# Altium schematic sheet FAN_CTRL.SchDoc
size A4
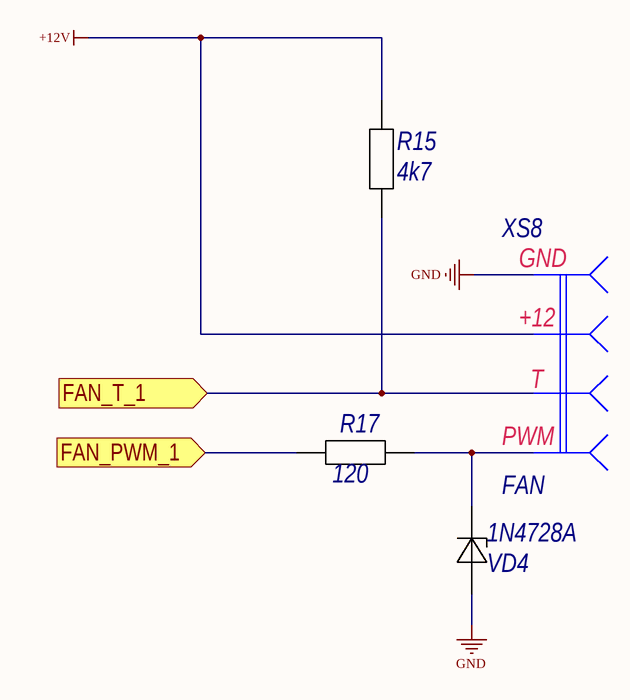
[diagram p0: FAN_CTRL.SchDoc]

## Parts
R15  4k7  [C0805R]
R17  120  [C0805R]
VD4  1N4728A  [DO-41]
XS8  FAN  [WF-4]

## Ports
FAN_PWM_1 (in), FAN_T_1 (in)

## Nets
+12V: R15.2 XS8.2
GND: VD4.1(А) XS8.1
FAN_PWM_1: R17.1 ; port FAN_PWM_1
FAN_T_1: R15.1 XS8.3 ; port FAN_T_1
NetR17_2: R17.2 VD4.2(К) XS8.4

## Notes on the sheet
- (in symbol FAN_CON) GND; +12; T; PWM

## Library data of the parts
R15 R17 = RES_0805: Published: 24.03.2010; Publisher: Andrew Danich; Type: Резистор
VD4 = 1N4728A: Type: Стабилитрон; Published: 20.05.2013; Publisher: Andrew Danich
XS8 = FAN_CON: Value: Connector; Published: 07.03.2013; Publisher: Andrew Danich; Type: Розетка